# Altium schematic sheet STM32G473QETx_LQFP128_MCU.SchDoc: STM32G473CETx Microcontroller
size A4
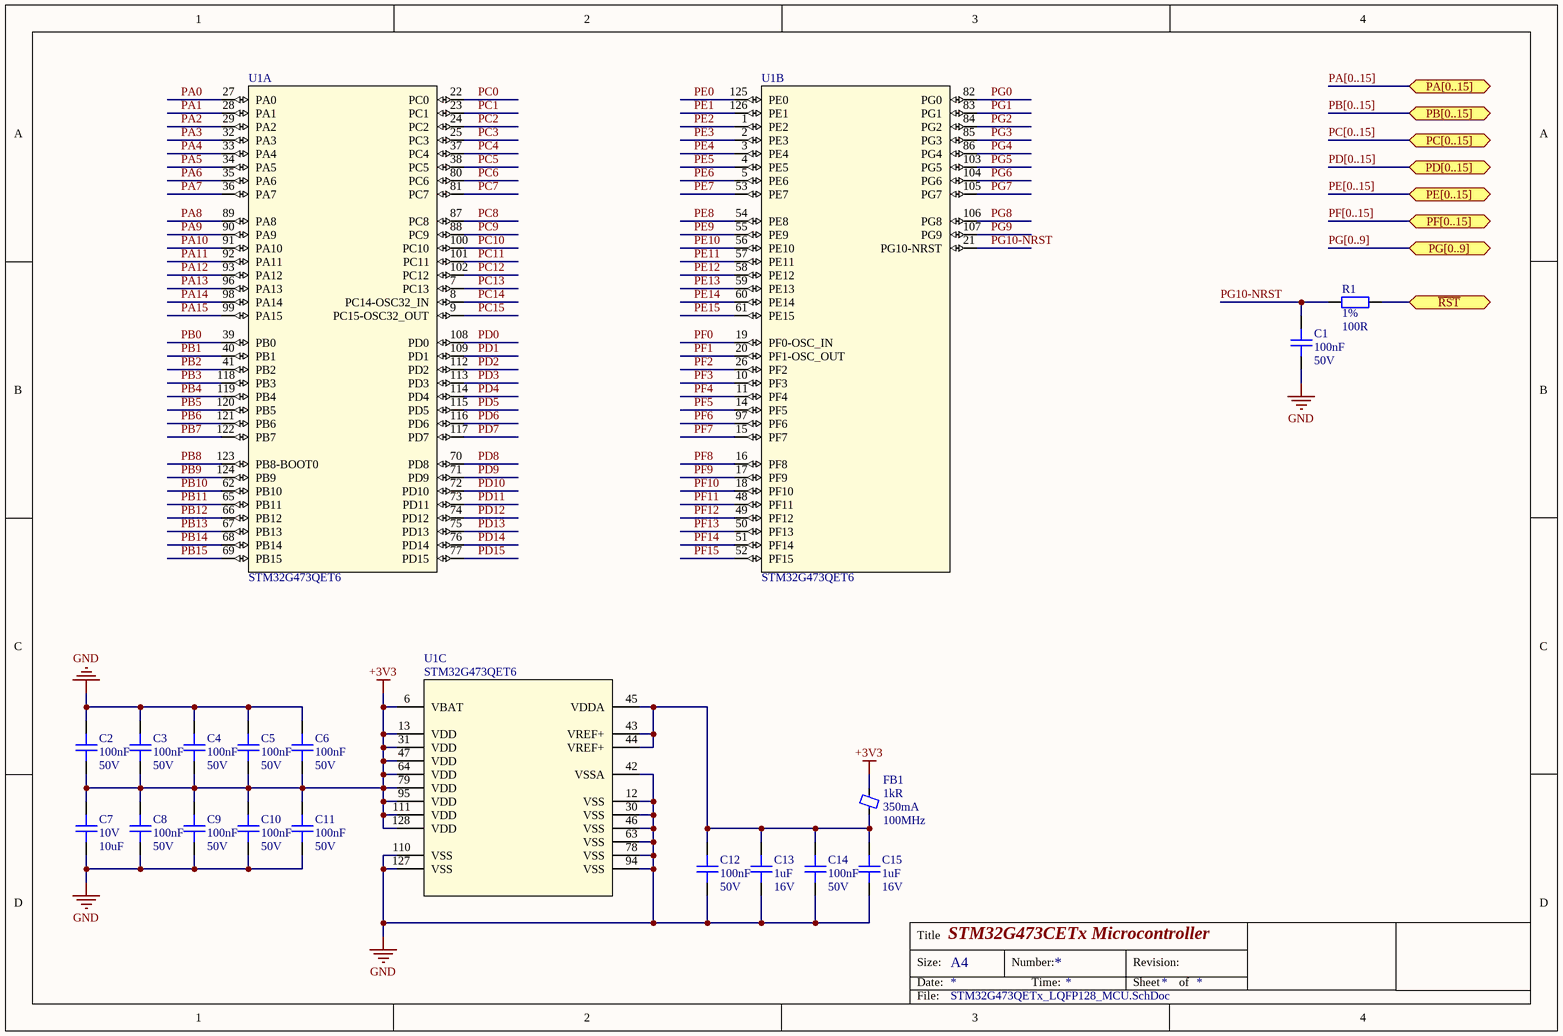
[diagram p0: STM32G473QETx_LQFP128_MCU.SchDoc]

## Parts
C1  Capacitance: 100nF  Voltage: 50V  [C0402]  (hidden comment: CAP CER 0.1UF 50V X7R 0402)
C2  Capacitance: 100nF  Voltage: 50V  [C0402]  (hidden comment: CAP CER 0.1UF 50V X7R 0402)
C3  Capacitance: 100nF  Voltage: 50V  [C0402]  (hidden comment: CAP CER 0.1UF 50V X7R 0402)
C4  Capacitance: 100nF  Voltage: 50V  [C0402]  (hidden comment: CAP CER 0.1UF 50V X7R 0402)
C5  Capacitance: 100nF  Voltage: 50V  [C0402]  (hidden comment: CAP CER 0.1UF 50V X7R 0402)
C6  Capacitance: 100nF  Voltage: 50V  [C0402]  (hidden comment: CAP CER 0.1UF 50V X7R 0402)
C7  Voltage Rating: 10V  Capacitance: 10uF  [C0805]  (hidden comment: CAP CER 10uF X7R 10% 0805)
C8  Capacitance: 100nF  Voltage: 50V  [C0402]  (hidden comment: CAP CER 0.1UF 50V X7R 0402)
C9  Capacitance: 100nF  Voltage: 50V  [C0402]  (hidden comment: CAP CER 0.1UF 50V X7R 0402)
C10  Capacitance: 100nF  Voltage: 50V  [C0402]  (hidden comment: CAP CER 0.1UF 50V X7R 0402)
C11  Capacitance: 100nF  Voltage: 50V  [C0402]  (hidden comment: CAP CER 0.1UF 50V X7R 0402)
C12  Capacitance: 100nF  Voltage: 50V  [C0402]  (hidden comment: CAP CER 0.1UF 50V X7R 0402)
C13  Capacitance: 1uF  Voltage Rating: 16V  [C0402]  (hidden comment: CAP CER 1UF 16V X5R 0402)
C14  Capacitance: 100nF  Voltage: 50V  [C0402]  (hidden comment: CAP CER 0.1UF 50V X7R 0402)
C15  Capacitance: 1uF  Voltage Rating: 16V  [C0402]  (hidden comment: CAP CER 1UF 16V X5R 0402)
FB1  Impedance: 1kR  Max DC Current: 350mA  Test Frequency: 100MHz  [L0402]  (hidden comment: FERRITE BEAD 1 KOHM 0402 1LN)
R1  Tolerance: 1%  Resistance: 100R  [R0402]  (hidden comment: RES SMD 100 OHM 1% 1/16W 0402)
U1  STM32G473QET6  [LPQFP-128]  (parts A,B,C of 3)

## Ports
PA[0..15] (bidir), PB[0..15] (bidir), PC[0..15] (bidir), PD[0..15] (bidir), PE[0..15] (bidir), PF[0..15] (bidir), PG[0..9] (bidir), ~{RST} (bidir)

## Nets
+3V3: C2.2 C3.2 C4.2 C5.2 C6.1 C7.1 C8.1 C9.1 C10.1 C11.1 FB1.2 U1.6(VBAT) U1.13(VDD) U1.31(VDD) U1.47(VDD) U1.64(VDD) U1.79(VDD) U1.95(VDD) U1.111(VDD) U1.128(VDD)
GND: C1.2 C2.1 C3.1 C4.1 C5.1 C6.2 C7.2 C8.2 C9.2 C10.2 C11.2 C12.1 C13.1 C14.1 C15.1 U1.12(VSS) U1.30(VSS) U1.42(VSSA) U1.46(VSS) U1.63(VSS) U1.78(VSS) U1.94(VSS) U1.110(VSS) U1.127(VSS)
~{RST}: R1.1 ; port ~{RST}
PA0: U1.27(PA0)
PA1: U1.28(PA1)
PA2: U1.29(PA2)
PA3: U1.32(PA3)
PA4: U1.33(PA4)
PA5: U1.34(PA5)
PA6: U1.35(PA6)
PA7: U1.36(PA7)
PA8: U1.89(PA8)
PA9: U1.90(PA9)
PA10: U1.91(PA10)
PA11: U1.92(PA11)
PA12: U1.93(PA12)
PA13: U1.96(PA13)
PA14: U1.98(PA14)
PA15: U1.99(PA15)
PB0: U1.39(PB0)
PB1: U1.40(PB1)
PB2: U1.41(PB2)
PB3: U1.118(PB3)
PB4: U1.119(PB4)
PB5: U1.120(PB5)
PB6: U1.121(PB6)
PB7: U1.122(PB7)
PB8: U1.123(PB8-BOOT0)
PB9: U1.124(PB9)
PB10: U1.62(PB10)
PB11: U1.65(PB11)
PB12: U1.66(PB12)
PB13: U1.67(PB13)
PB14: U1.68(PB14)
PB15: U1.69(PB15)
PC0: U1.22(PC0)
PC1: U1.23(PC1)
PC2: U1.24(PC2)
PC3: U1.25(PC3)
PC4: U1.37(PC4)
PC5: U1.38(PC5)
PC6: U1.80(PC6)
PC7: U1.81(PC7)
PC8: U1.87(PC8)
PC9: U1.88(PC9)
PC10: U1.100(PC10)
PC11: U1.101(PC11)
PC12: U1.102(PC12)
PC13: U1.7(PC13)
PC14: U1.8(PC14-OSC32_IN)
PC15: U1.9(PC15-OSC32_OUT)
PD0: U1.108(PD0)
PD1: U1.109(PD1)
PD2: U1.112(PD2)
PD3: U1.113(PD3)
PD4: U1.114(PD4)
PD5: U1.115(PD5)
PD6: U1.116(PD6)
PD7: U1.117(PD7)
PD8: U1.70(PD8)
PD9: U1.71(PD9)
PD10: U1.72(PD10)
PD11: U1.73(PD11)
PD12: U1.74(PD12)
PD13: U1.75(PD13)
PD14: U1.76(PD14)
PD15: U1.77(PD15)
PE0: U1.125(PE0)
PE1: U1.126(PE1)
PE2: U1.1(PE2)
PE3: U1.2(PE3)
PE4: U1.3(PE4)
PE5: U1.4(PE5)
PE6: U1.5(PE6)
PE7: U1.53(PE7)
PE8: U1.54(PE8)
PE9: U1.55(PE9)
PE10: U1.56(PE10)
PE11: U1.57(PE11)
PE12: U1.58(PE12)
PE13: U1.59(PE13)
PE14: U1.60(PE14)
PE15: U1.61(PE15)
PF0: U1.19(PF0-OSC_IN)
PF1: U1.20(PF1-OSC_OUT)
PF2: U1.26(PF2)
PF3: U1.10(PF3)
PF4: U1.11(PF4)
PF5: U1.14(PF5)
PF6: U1.97(PF6)
PF7: U1.15(PF7)
PF8: U1.16(PF8)
PF9: U1.17(PF9)
PF10: U1.18(PF10)
PF11: U1.48(PF11)
PF12: U1.49(PF12)
PF13: U1.50(PF13)
PF14: U1.51(PF14)
PF15: U1.52(PF15)
PG0: U1.82(PG0)
PG1: U1.83(PG1)
PG2: U1.84(PG2)
PG3: U1.85(PG3)
PG4: U1.86(PG4)
PG5: U1.103(PG5)
PG6: U1.104(PG6)
PG7: U1.105(PG7)
PG8: U1.106(PG8)
PG9: U1.107(PG9)
PG10-NRST: C1.1 R1.2 U1.21(PG10-NRST)
NetC12_2: C12.2 C13.2 C14.2 C15.2 FB1.1 U1.43(VREF+) U1.44(VREF+) U1.45(VDDA)

## Buses and harness runs
bus PA[0..15] = port PA[0..15]
bus PB[0..15] = port PB[0..15]
bus PC[0..15] = port PC[0..15]
bus PD[0..15] = port PD[0..15]
bus PE[0..15] = port PE[0..15]
bus PF[0..15] = port PF[0..15]
bus PG[0..9] = port PG[0..9]

## Notes on the sheet
- Title
- Size:
- Date:
- A4
- Number:
- Time:
- Revision:
- Sheet
- of
- File:

## Library data of the parts
C1-C6 C8-C12 C14 = CAP CER 0.1UF 50V X7R 0402: 0.1µF ±10% 50V Ceramic Capacitor X7R 0402 (1005 Metric); Manufacturer: TDK; Manufacturer Part Number: CGA2B3X7R1H104K050BB; Supplier 1: Digi-Key; Stock 1: 2925303; Pricing 1: 1=0.17, 10=0.118, 50=0.0668, 100=0.0553, 500=0.0388, 1000=0.0321, 2500=0.0299, 5000=0.0273 (USD); Mount: Surface Mount; Case/Package: 0402; Weight: 2.3E-05oz; Case Code (Metric): 1005; Case Code (Imperial): 0402; Min Operating Temperature: -55°C; Max Operating Temperature: 125°C; Voltage Rating: 50V; Tolerance: 10%; Packaging: Tape and Reel; Package Quantity: 1; Voltage Rating (DC): 50V; Dielectric: X7R; Termination: SMD/SMT; Composition: Ceramic; Length: 1mm; Height: 0.5mm; Width: 0.02inch; Thickness: 0.022inch; Depth: 0.5mm; Ratings: AEC-Q200; REACH SVHC: No SVHC; Lead Free: Lead Free; ComponentLink1URL: http://product.tdk.com/capacitor/mlcc/en/documents/mlccspec_automotive_general_midvoltage_en.pdf?src-supplier=Future+Electronics; ComponentLink1Description: http://product.tdk.com/capacitor/mlcc/en/documents/mlccspec_automotive_general_midvoltage_en.pdf?src-supplier=Future+Electronics; ComponentLink2URL: http://www.farnell.com/datasheets/1807242.pdf?src-supplier=Element14; ComponentLink2Description: http://www.farnell.com/datasheets/1807242.pdf?src-supplier=Element14; ComponentLink3URL: http://www.mouser.com/ds/2/400/lcc_automotive_general_en-843974.pdf?src-supplier=Mouser; ComponentLink3Description: http://www.mouser.com/ds/2/400/lcc_automotive_general_en-843974.pdf?src-supplier=Mouser; ComponentLink4URL: http://www.farnell.com/datasheets/1936565.pdf?src-supplier=Element14; ComponentLink4Description: http://www.farnell.com/datasheets/1936565.pdf?src-supplier=Element14; ComponentLink5URL: http://www.farnell.com/datasheets/1735392.pdf?src-supplier=Element14; ComponentLink5Description: http://www.farnell.com/datasheets/1735392.pdf?src-supplier=Element14; Supplier Part Number 1: 445-6899-1-ND
C7 = CAP CER 10uF X7R 10% 0805: Capacitor,10uF,10V,X7R,10%,0805,Murata; Manufacturer Part Number: GRM21BR71A106KA73L; Supplier 1: Digi-Key; Manufacturer: Murata; Stock 1: 2099435; Pricing 1: 1=0.26, 10=0.176, 100=0.089, 500=0.0609, 1000=0.0538 (USD); Mount: Surface Mount; Case Code (Imperial): 0805; Case Code (Metric): 2012; Min Operating Temperature: -55°C; Max Operating Temperature: 125°C; Voltage Rating (DC): 10V; Tolerance: 10%; Packaging: Tape and Reel; Package Quantity: 3000; Dielectric: X7R; Termination: SMD/SMT; Length: 2mm; Height: 1.25mm; Width: 1.25mm; Thickness: 0.055inch; Depth: 1.25mm; REACH SVHC: No SVHC; ComponentLink1URL: http://components.arrow.com/part/dataview/0323_07281730?src-supplier=Arrow+Europe; ComponentLink1Description: http://components.arrow.com/part/dataview/0323_07281730?src-supplier=Arrow+Europe; ComponentLink2URL: http://www.mouser.com/ds/2/281/c02e-2905.pdf?src-supplier=Mouser; ComponentLink2Description: http://www.mouser.com/ds/2/281/c02e-2905.pdf?src-supplier=Mouser; ComponentLink3URL: http://www.farnell.com/datasheets/2079188.pdf?src-supplier=Newark; ComponentLink3Description: http://www.farnell.com/datasheets/2079188.pdf?src-supplier=Newark; ComponentLink4URL: http://www.farnell.com/datasheets/2079188.pdf?src-supplier=Farnell; ComponentLink4Description: http://www.farnell.com/datasheets/2079188.pdf?src-supplier=Farnell; Supplier Part Number 1: 490-10516-1-ND; Case/Package: 0805; ComponentLink5URL: http://www.farnell.com/datasheets/2079188.pdf?src-supplier=Element14; ComponentLink5Description: http://www.farnell.com/datasheets/2079188.pdf?src-supplier=Element14; Weight: 0.000335oz; ComponentLink6URL: http://search.murata.co.jp/Ceramy/image/img/A01X/G101/ENG/GRM21BR71A106KA73-01.pdf?src-supplier=Digi-Key; ComponentLink6Description: http://search.murata.co.jp/Ceramy/image/img/A01X/G101/ENG/GRM21BR71A106KA73-01.pdf?src-supplier=Digi-Key
C13 C15 = CAP CER 1UF 16V X5R 0402: 1µF ±10% 16V Ceramic Capacitor X5R 0402 (1005 Metric); Manufacturer: Yageo; Manufacturer Part Number: CC0402KRX5R7BB105; Supplier 1: Digi-Key; Stock 1: 1114963; Pricing 1: 1=0.4, 10=0.278, 100=0.167, 500=0.1253, 1000=0.1058, 2500=0.1002, 5000=0.0947 (USD); Mount: Surface Mount; Weight: 2.3E-05oz; Case Code (Imperial): 0402; Case Code (Metric): 1005; Min Operating Temperature: -55°C; Max Operating Temperature: 85°C; Tolerance: 10%; Packaging: Tape and Reel; Voltage Rating (DC): 16V; Dielectric: X5R; Termination: SMD/SMT; Composition: Ceramic; Length: 1mm; Height: 0.5mm; Width: 0.02inch; Depth: 0.5mm; Thickness: 0.022inch; Radiation Hardening: No; Lead Free: Lead Free; Halogen Free: Halogen Free; ComponentLink1URL: http://www.yageo.com/documents/recent/UPY-GPHC_X5R_4V-to-50V_12.pdf?src-supplier=Avnet+Europe; ComponentLink1Description: http://www.yageo.com/documents/recent/UPY-GPHC_X5R_4V-to-50V_12.pdf?src-supplier=Avnet+Europe; Supplier Part Number 1: 311-1691-1-ND; Case/Package: 0402
FB1 = FERRITE BEAD 1 KOHM 0402 1LN: 1 kOhms @ 100MHz 1  Ferrite Bead 0402 (1005 Metric) 350mA 490mOhm; Manufacturer: Murata; Manufacturer Part Number: BLM15AX102SN1D; Material: Ferrite,Steel; Tolerance: 25%; Number of Lines: 1; DC Resistance (DCR): 490mR; Supplier 1: Digi-Key; Stock 1: 138597; Pricing 1: 1=0.11, 10=0.09, 25=0.0812, 50=0.0596, 100=0.0514, 250=0.0406, 500=0.0343, 1000=0.0289, 5000=0.0257 (USD); Case/Package: 0402; Number of Pins: 2; Case Code (Metric): 1005; Case Code (Imperial): 0402; Min Operating Temperature: -55°C; Max Operating Temperature: 125°C; Package Quantity: 1; Packaging: Tape and Reel; Current Rating: 350mA; Max Current Rating: 350mA; Termination: SMD/SMT; Number of Circuits: 1; Length: 1mm; Height: 0.5mm; Width: 0.5mm; Depth: 0.5mm; REACH SVHC: No SVHC; Lead Free: Lead Free; ComponentLink1URL: https://www.murata.com/en-us/products/productdata/8796740059166/ENFA0018.pdf?src-supplier=Digi-Key; ComponentLink1Description: https://www.murata.com/en-us/products/productdata/8796740059166/ENFA0018.pdf?src-supplier=Digi-Key; ComponentLink2URL: http://search.murata.co.jp/Ceramy/image/img/PDF/ENG/L0110S0100BLM15AX_SN.pdf?src-supplier=Future+Electronics; ComponentLink2Description: http://search.murata.co.jp/Ceramy/image/img/PDF/ENG/L0110S0100BLM15AX_SN.pdf?src-supplier=Future+Electronics; ComponentLink3URL: http://www.produktinfo.conrad.com/datenblaetter/1100000-1199999/001171674-da-01-en-CHIP_DROSSEL0402_1000R_350MA_1_0X0_5MM.pdf?src-supplier=Conrad; ComponentLink3Description: http://www.produktinfo.conrad.com/datenblaetter/1100000-1199999/001171674-da-01-en-CHIP_DROSSEL0402_1000R_350MA_1_0X0_5MM.pdf?src-supplier=Conrad; ComponentLink4URL: http://www.produktinfo.conrad.com/datenblaetter/1100000-1199999/001172166-da-01-en-DROSSEL_0402_1000R_31_0X0_5MM_10000ST.pdf?src-supplier=Conrad; ComponentLink4Description: http://www.produktinfo.conrad.com/datenblaetter/1100000-1199999/001172166-da-01-en-DROSSEL_0402_1000R_31_0X0_5MM_10000ST.pdf?src-supplier=Conrad; Supplier Part Number 1: 490-5442-1-ND; Mount: Surface Mount
R1 = RES SMD 100 OHM 1% 1/16W 0402: 100 Ohms ±1% 0.063W, 1/16W Chip Resistor 0402 (1005 Metric) Moisture Resistant Thick Film; Manufacturer: Yageo; Manufacturer Part Number: RC0402FR-07100RL; Power Rating: 62.5mW; Voltage Rating: 50V; Temperature Coefficient: 100ppm/°C; Supplier 1: Digi-Key; Stock 1: 16989760; Pricing 1: 1=0.1, 10=0.016, 100=0.0064, 1000=0.0029, 2500=0.0025, 5000=0.0021 (USD); Case/Package: 0402; Number of Pins: 2; Case Code (Imperial): 0402; Case Code (Metric): 1005; Min Operating Temperature: -55°C; Max Operating Temperature: 155°C; Voltage Rating (DC): 50V; Packaging: Tape and Reel; Termination: SMD/SMT; Composition: Thick Film; Military Standard: Not; Length: 1mm; Height: 0.32mm; Width: 0.5mm; Depth: 0.5mm; REACH SVHC: No SVHC; Lead Free: Lead Free; ComponentLink1URL: http://www.farnell.com/datasheets/2167052.pdf?src-supplier=Element14; ComponentLink1Description: http://www.farnell.com/datasheets/2167052.pdf?src-supplier=Element14; ComponentLink2URL: http://www.yageo.com/documents/recent/PYu-RC_Group_51_RoHS_L_9.pdf?src-supplier=Mouser; ComponentLink2Description: http://www.yageo.com/documents/recent/PYu-RC_Group_51_RoHS_L_9.pdf?src-supplier=Mouser; ComponentLink3URL: http://www.yageo.com/documents/recent/PYu-RC0402_51_RoHS_L_6_r.pdf?src-supplier=Future+Electronics; ComponentLink3Description: http://www.yageo.com/documents/recent/PYu-RC0402_51_RoHS_L_6_r.pdf?src-supplier=Future+Electronics; ComponentLink4URL: https://www.verical.com/server-webapp/html/getDatasheet?partID=329466&src-supplier=Verical; ComponentLink4Description: https://www.verical.com/server-webapp/html/getDatasheet?partID=329466&src-supplier=Verical; ComponentLink5URL: http://www.farnell.com/datasheets/1018594.pdf?src-supplier=Element14; ComponentLink5Description: http://www.farnell.com/datasheets/1018594.pdf?src-supplier=Element14; ComponentLink6URL: http://documents.rs-components.com/techlib://itc_doclist_GB.htm?stockno=6185810&src-supplier=RSComponents; ComponentLink6Description: http://documents.rs-components.com/techlib://itc_doclist_GB.htm?stockno=6185810&src-supplier=RSComponents; Supplier Part Number 1: 311-100LRDKR-ND; Mount: Surface Mount
U1 = IC STM32G473QETx MCU 32BIT 512KB FLASH 128LQFP: ARM® Cortex®-M4 STM32G4 Microcontroller IC 32-Bit 170MHz 512KB (512K x 8) FLASH 128-LQFP (14x14); Manufacturer: STMicroelectronics; Supplier 1: Digi-Key; Manufacturer Part Number: STM32G473QET6; Stock 1: 0; Pricing 1: 540=7.5029 (USD); Supplier Part Number 1: 497-STM32G473QET6-ND